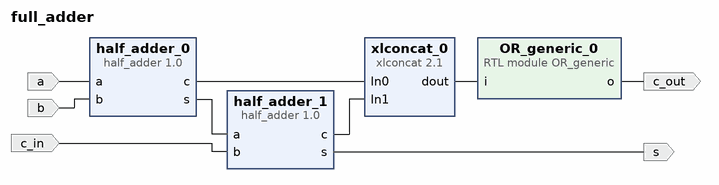
[diagram p0: block diagram of the top level]
# Vivado block design full_adder, xc7z020clg400-1, Vivado 2023.2
create_bd_design full_adder

create_bd_port -dir I a
create_bd_port -dir I b
create_bd_port -dir I c_in
create_bd_port -dir O s
create_bd_port -dir O c_out

create_bd_cell -type ip -vlnv user.org:user:half_adder:1.0 half_adder_0
create_bd_cell -type module -reference OR_generic OR_generic_0
set_property -dict {CONFIG.n_inputs 2} [get_bd_cells OR_generic_0]
create_bd_cell -type ip -vlnv xilinx.com:ip:xlconcat:2.1 xlconcat_0
create_bd_cell -type ip -vlnv user.org:user:half_adder:1.0 half_adder_1

# ---- connections ----

connect_bd_net [get_bd_pins OR_generic_0/o] [get_bd_ports c_out]
connect_bd_net [get_bd_ports a] [get_bd_pins half_adder_0/a]
connect_bd_net [get_bd_ports b] [get_bd_pins half_adder_0/b]
connect_bd_net [get_bd_ports c_in] [get_bd_pins half_adder_1/b]
connect_bd_net [get_bd_pins half_adder_0/c] [get_bd_pins xlconcat_0/In0]
connect_bd_net [get_bd_pins half_adder_0/s] [get_bd_pins half_adder_1/a]
connect_bd_net [get_bd_pins half_adder_1/c] [get_bd_pins xlconcat_0/In1]
connect_bd_net [get_bd_pins half_adder_1/s] [get_bd_ports s]
connect_bd_net [get_bd_pins xlconcat_0/dout] [get_bd_pins OR_generic_0/i]

validate_bd_design
save_bd_design
